# EAGLE design 40ish (EAGLE 9.6.1)
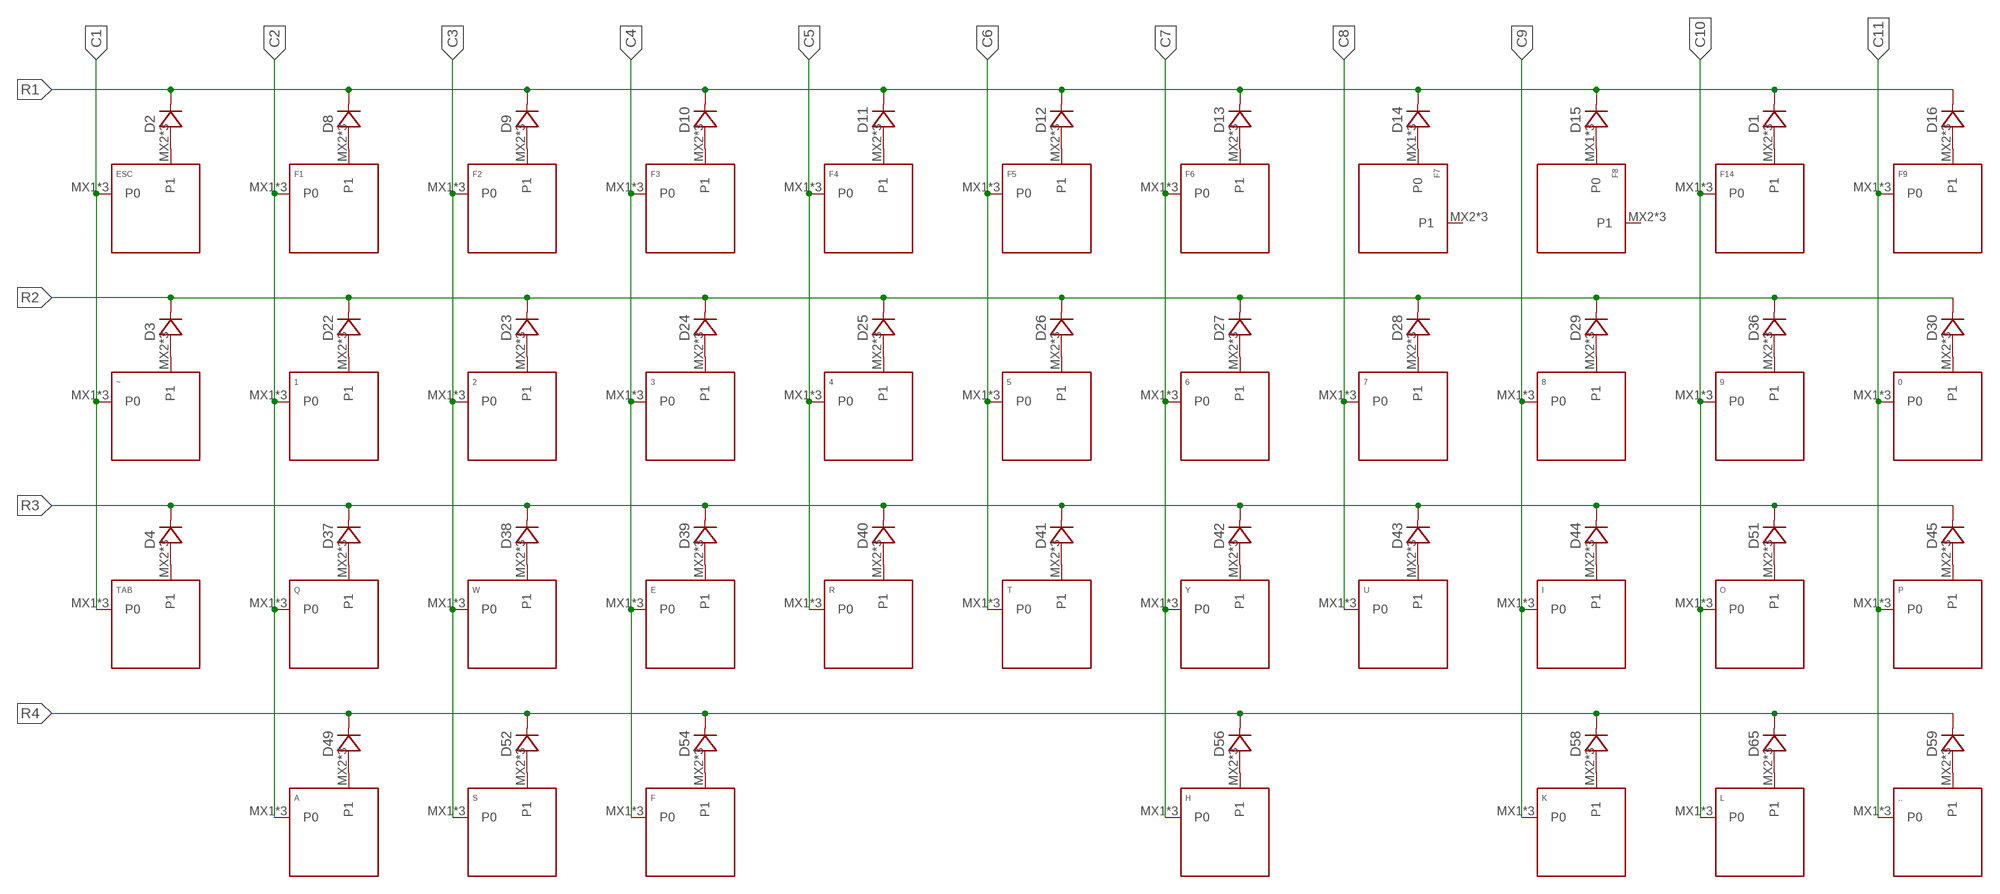
[diagram p0: schematic, sheet 1]

## Parts
0  KEYSWITCH-PLAIN-MXHSPCB-1U  [MXHSPCB-1U]
1  KEYSWITCH-PLAIN-MXHSPCB-1U  [MXHSPCB-1U]
2  KEYSWITCH-PLAIN-MXHSPCB-1U  [MXHSPCB-1U]
3  KEYSWITCH-PLAIN-MXHSPCB-1U  [MXHSPCB-1U]
4  KEYSWITCH-PLAIN-MXHSPCB-1U  [MXHSPCB-1U]
5  KEYSWITCH-PLAIN-MXHSPCB-1U  [MXHSPCB-1U]
6  KEYSWITCH-PLAIN-MXHSPCB-1U  [MXHSPCB-1U]
7  KEYSWITCH-PLAIN-MXHSPCB-1U  [MXHSPCB-1U]
8  KEYSWITCH-PLAIN-MXHSPCB-1U  [MXHSPCB-1U]
9  KEYSWITCH-PLAIN-MXHSPCB-1U  [MXHSPCB-1U]
..  KEYSWITCH-PLAIN-MXHSPCB-1U  [MXHSPCB-1U]
A  KEYSWITCH-PLAIN-MXHSPCB-1U  [MXHSPCB-1U]
D1  DIODE-SOD-123  [SOD-123]
D2  DIODE-SOD-123  [SOD-123]
D3  DIODE-SOD-123  [SOD-123]
D4  DIODE-SOD-123  [SOD-123]
D8  DIODE-SOD-123  [SOD-123]
D9  DIODE-SOD-123  [SOD-123]
D10  DIODE-SOD-123  [SOD-123]
D11  DIODE-SOD-123  [SOD-123]
D12  DIODE-SOD-123  [SOD-123]
D13  DIODE-SOD-123  [SOD-123]
D14  DIODE-SOD-123  [SOD-123]
D15  DIODE-SOD-123  [SOD-123]
D16  DIODE-SOD-123  [SOD-123]
D22  DIODE-SOD-123  [SOD-123]
D23  DIODE-SOD-123  [SOD-123]
D24  DIODE-SOD-123  [SOD-123]
D25  DIODE-SOD-123  [SOD-123]
D26  DIODE-SOD-123  [SOD-123]
D27  DIODE-SOD-123  [SOD-123]
D28  DIODE-SOD-123  [SOD-123]
D29  DIODE-SOD-123  [SOD-123]
D30  DIODE-SOD-123  [SOD-123]
D36  DIODE-SOD-123  [SOD-123]
D37  DIODE-SOD-123  [SOD-123]
D38  DIODE-SOD-123  [SOD-123]
D39  DIODE-SOD-123  [SOD-123]
D40  DIODE-SOD-123  [SOD-123]
D41  DIODE-SOD-123  [SOD-123]
D42  DIODE-SOD-123  [SOD-123]
D43  DIODE-SOD-123  [SOD-123]
D44  DIODE-SOD-123  [SOD-123]
D45  DIODE-SOD-123  [SOD-123]
D49  DIODE-SOD-123  [SOD-123]
D51  DIODE-SOD-123  [SOD-123]
D52  DIODE-SOD-123  [SOD-123]
D54  DIODE-SOD-123  [SOD-123]
D56  DIODE-SOD-123  [SOD-123]
D58  DIODE-SOD-123  [SOD-123]
D59  DIODE-SOD-123  [SOD-123]
D65  DIODE-SOD-123  [SOD-123]
E  KEYSWITCH-PLAIN-MXHSPCB-1U  [MXHSPCB-1U]
ESC  KEYSWITCH-PLAIN-MXHSPCB-1U  [MXHSPCB-1U]
F  KEYSWITCH-PLAIN-MXHSPCB-1U  [MXHSPCB-1U]
F1  KEYSWITCH-PLAIN-MXHSPCB-1U  [MXHSPCB-1U]
F2  KEYSWITCH-PLAIN-MXHSPCB-1U  [MXHSPCB-1U]
F3  KEYSWITCH-PLAIN-MXHSPCB-1U  [MXHSPCB-1U]
F4  KEYSWITCH-PLAIN-MXHSPCB-1U  [MXHSPCB-1U]
F5  KEYSWITCH-PLAIN-MXHSPCB-1U  [MXHSPCB-1U]
F6  KEYSWITCH-PLAIN-MXHSPCB-1U  [MXHSPCB-1U]
F7  KEYSWITCH-PLAIN-MXHSPCB-1U  [MXHSPCB-1U]
F8  KEYSWITCH-PLAIN-MXHSPCB-1U  [MXHSPCB-1U]
F9  KEYSWITCH-PLAIN-MXHSPCB-1U  [MXHSPCB-1U]
F14  KEYSWITCH-PLAIN-MXHSPCB-1U  [MXHSPCB-1U]
H  KEYSWITCH-PLAIN-MXHSPCB-1U  [MXHSPCB-1U]
I  KEYSWITCH-PLAIN-MXHSPCB-1U  [MXHSPCB-1U]
K  KEYSWITCH-PLAIN-MXHSPCB-1U  [MXHSPCB-1U]
L  KEYSWITCH-PLAIN-MXHSPCB-1U  [MXHSPCB-1U]
O  KEYSWITCH-PLAIN-MXHSPCB-1U  [MXHSPCB-1U]
P  KEYSWITCH-PLAIN-MXHSPCB-1U  [MXHSPCB-1U]
Q  KEYSWITCH-PLAIN-MXHSPCB-1U  [MXHSPCB-1U]
R  KEYSWITCH-PLAIN-MXHSPCB-1U  [MXHSPCB-1U]
S  KEYSWITCH-PLAIN-MXHSPCB-1U  [MXHSPCB-1U]
T  KEYSWITCH-PLAIN-MXHSPCB-1U  [MXHSPCB-1U]
TAB  KEYSWITCH-PLAIN-MXHSPCB-1U  [MXHSPCB-1U]
U  KEYSWITCH-PLAIN-MXHSPCB-1U  [MXHSPCB-1U]
W  KEYSWITCH-PLAIN-MXHSPCB-1U  [MXHSPCB-1U]
Y  KEYSWITCH-PLAIN-MXHSPCB-1U  [MXHSPCB-1U]
~  KEYSWITCH-PLAIN-MXHSPCB-1U  [MXHSPCB-1U]

## Nets
C1: ESC.MX1(P0) ESC.P$1(P0) ESC.P$2(P0) TAB.MX1(P0) TAB.P$1(P0) TAB.P$2(P0) ~.MX1(P0) ~.P$1(P0) ~.P$2(P0)
C2: 1.MX1(P0) 1.P$1(P0) 1.P$2(P0) A.MX1(P0) A.P$1(P0) A.P$2(P0) F1.MX1(P0) F1.P$1(P0) F1.P$2(P0) Q.MX1(P0) Q.P$1(P0) Q.P$2(P0)
C3: 2.MX1(P0) 2.P$1(P0) 2.P$2(P0) F2.MX1(P0) F2.P$1(P0) F2.P$2(P0) S.MX1(P0) S.P$1(P0) S.P$2(P0) W.MX1(P0) W.P$1(P0) W.P$2(P0)
C4: 3.MX1(P0) 3.P$1(P0) 3.P$2(P0) E.MX1(P0) E.P$1(P0) E.P$2(P0) F3.MX1(P0) F3.P$1(P0) F3.P$2(P0) F.MX1(P0) F.P$1(P0) F.P$2(P0)
C5: 4.MX1(P0) 4.P$1(P0) 4.P$2(P0) F4.MX1(P0) F4.P$1(P0) F4.P$2(P0) R.MX1(P0) R.P$1(P0) R.P$2(P0)
C6: 5.MX1(P0) 5.P$1(P0) 5.P$2(P0) F5.MX1(P0) F5.P$1(P0) F5.P$2(P0) T.MX1(P0) T.P$1(P0) T.P$2(P0)
C7: 6.MX1(P0) 6.P$1(P0) 6.P$2(P0) F6.MX1(P0) F6.P$1(P0) F6.P$2(P0) H.MX1(P0) H.P$1(P0) H.P$2(P0) Y.MX1(P0) Y.P$1(P0) Y.P$2(P0)
C8: 7.MX1(P0) 7.P$1(P0) 7.P$2(P0) U.MX1(P0) U.P$1(P0) U.P$2(P0)
C9: 8.MX1(P0) 8.P$1(P0) 8.P$2(P0) I.MX1(P0) I.P$1(P0) I.P$2(P0) K.MX1(P0) K.P$1(P0) K.P$2(P0)
C10: 9.MX1(P0) 9.P$1(P0) 9.P$2(P0) F14.MX1(P0) F14.P$1(P0) F14.P$2(P0) L.MX1(P0) L.P$1(P0) L.P$2(P0) O.MX1(P0) O.P$1(P0) O.P$2(P0)
C11: 0.MX1(P0) 0.P$1(P0) 0.P$2(P0) ...MX1(P0) ...P$1(P0) ...P$2(P0) F9.MX1(P0) F9.P$1(P0) F9.P$2(P0) P.MX1(P0) P.P$1(P0) P.P$2(P0)
N$1: D2.A ESC.MX2(P1) ESC.P$3(P1) ESC.P$4(P1)
N$2: D3.A ~.MX2(P1) ~.P$3(P1) ~.P$4(P1)
N$3: D4.A TAB.MX2(P1) TAB.P$3(P1) TAB.P$4(P1)
N$4: D1.A F14.MX2(P1) F14.P$3(P1) F14.P$4(P1)
N$8: D8.A F1.MX2(P1) F1.P$3(P1) F1.P$4(P1)
N$9: D9.A F2.MX2(P1) F2.P$3(P1) F2.P$4(P1)
N$10: D10.A F3.MX2(P1) F3.P$3(P1) F3.P$4(P1)
N$11: D11.A F4.MX2(P1) F4.P$3(P1) F4.P$4(P1)
N$12: D12.A F5.MX2(P1) F5.P$3(P1) F5.P$4(P1)
N$13: D13.A F6.MX2(P1) F6.P$3(P1) F6.P$4(P1)
N$14: D14.A F7.MX1(P0) F7.P$1(P0) F7.P$2(P0)
N$15: D15.A F8.MX1(P0) F8.P$1(P0) F8.P$2(P0)
N$16: D16.A F9.MX2(P1) F9.P$3(P1) F9.P$4(P1)
N$24: 1.MX2(P1) 1.P$3(P1) 1.P$4(P1) D22.A
N$25: 2.MX2(P1) 2.P$3(P1) 2.P$4(P1) D23.A
N$26: 3.MX2(P1) 3.P$3(P1) 3.P$4(P1) D24.A
N$27: 4.MX2(P1) 4.P$3(P1) 4.P$4(P1) D25.A
N$28: 5.MX2(P1) 5.P$3(P1) 5.P$4(P1) D26.A
N$29: 6.MX2(P1) 6.P$3(P1) 6.P$4(P1) D27.A
N$30: 7.MX2(P1) 7.P$3(P1) 7.P$4(P1) D28.A
N$31: 8.MX2(P1) 8.P$3(P1) 8.P$4(P1) D29.A
N$32: 0.MX2(P1) 0.P$3(P1) 0.P$4(P1) D30.A
N$38: 9.MX2(P1) 9.P$3(P1) 9.P$4(P1) D36.A
N$39: D37.A Q.MX2(P1) Q.P$3(P1) Q.P$4(P1)
N$40: D38.A W.MX2(P1) W.P$3(P1) W.P$4(P1)
N$41: D39.A E.MX2(P1) E.P$3(P1) E.P$4(P1)
N$42: D40.A R.MX2(P1) R.P$3(P1) R.P$4(P1)
N$43: D41.A T.MX2(P1) T.P$3(P1) T.P$4(P1)
N$44: D42.A Y.MX2(P1) Y.P$3(P1) Y.P$4(P1)
N$45: D43.A U.MX2(P1) U.P$3(P1) U.P$4(P1)
N$54: D44.A I.MX2(P1) I.P$3(P1) I.P$4(P1)
N$55: D51.A O.MX2(P1) O.P$3(P1) O.P$4(P1)
N$56: D45.A P.MX2(P1) P.P$3(P1) P.P$4(P1)
N$62: A.MX2(P1) A.P$3(P1) A.P$4(P1) D49.A
N$63: D52.A S.MX2(P1) S.P$3(P1) S.P$4(P1)
N$65: D54.A F.MX2(P1) F.P$3(P1) F.P$4(P1)
N$69: D56.A H.MX2(P1) H.P$3(P1) H.P$4(P1)
N$71: D58.A K.MX2(P1) K.P$3(P1) K.P$4(P1)
N$72: D65.A L.MX2(P1) L.P$3(P1) L.P$4(P1)
N$73: ...MX2(P1) ...P$3(P1) ...P$4(P1) D59.A
R1: D1.C D2.C D8.C D9.C D10.C D11.C D12.C D13.C D14.C D15.C D16.C
R2: D3.C D22.C D23.C D24.C D25.C D26.C D27.C D28.C D29.C D30.C D36.C
R3: D4.C D37.C D38.C D39.C D40.C D41.C D42.C D43.C D44.C D45.C D51.C
R4: D49.C D52.C D54.C D56.C D58.C D59.C D65.C
Unconnected: F7.MX2(P1) F7.P$3(P1) F7.P$4(P1) F8.MX2(P1) F8.P$3(P1) F8.P$4(P1)

## Library data of the parts
0 1-9 .. A E ESC F F1-F9 F14 H I K L O P Q R S T TAB U W Y ~ = Keyboard:KEYSWITCH-PLAIN
D1-D4 D8-D16 D22-D30 D36-D45 D49 D51 D52 D54 D56 D58 D59 D65 = Components:DIODE: Standard 1N4148 diode

## Board
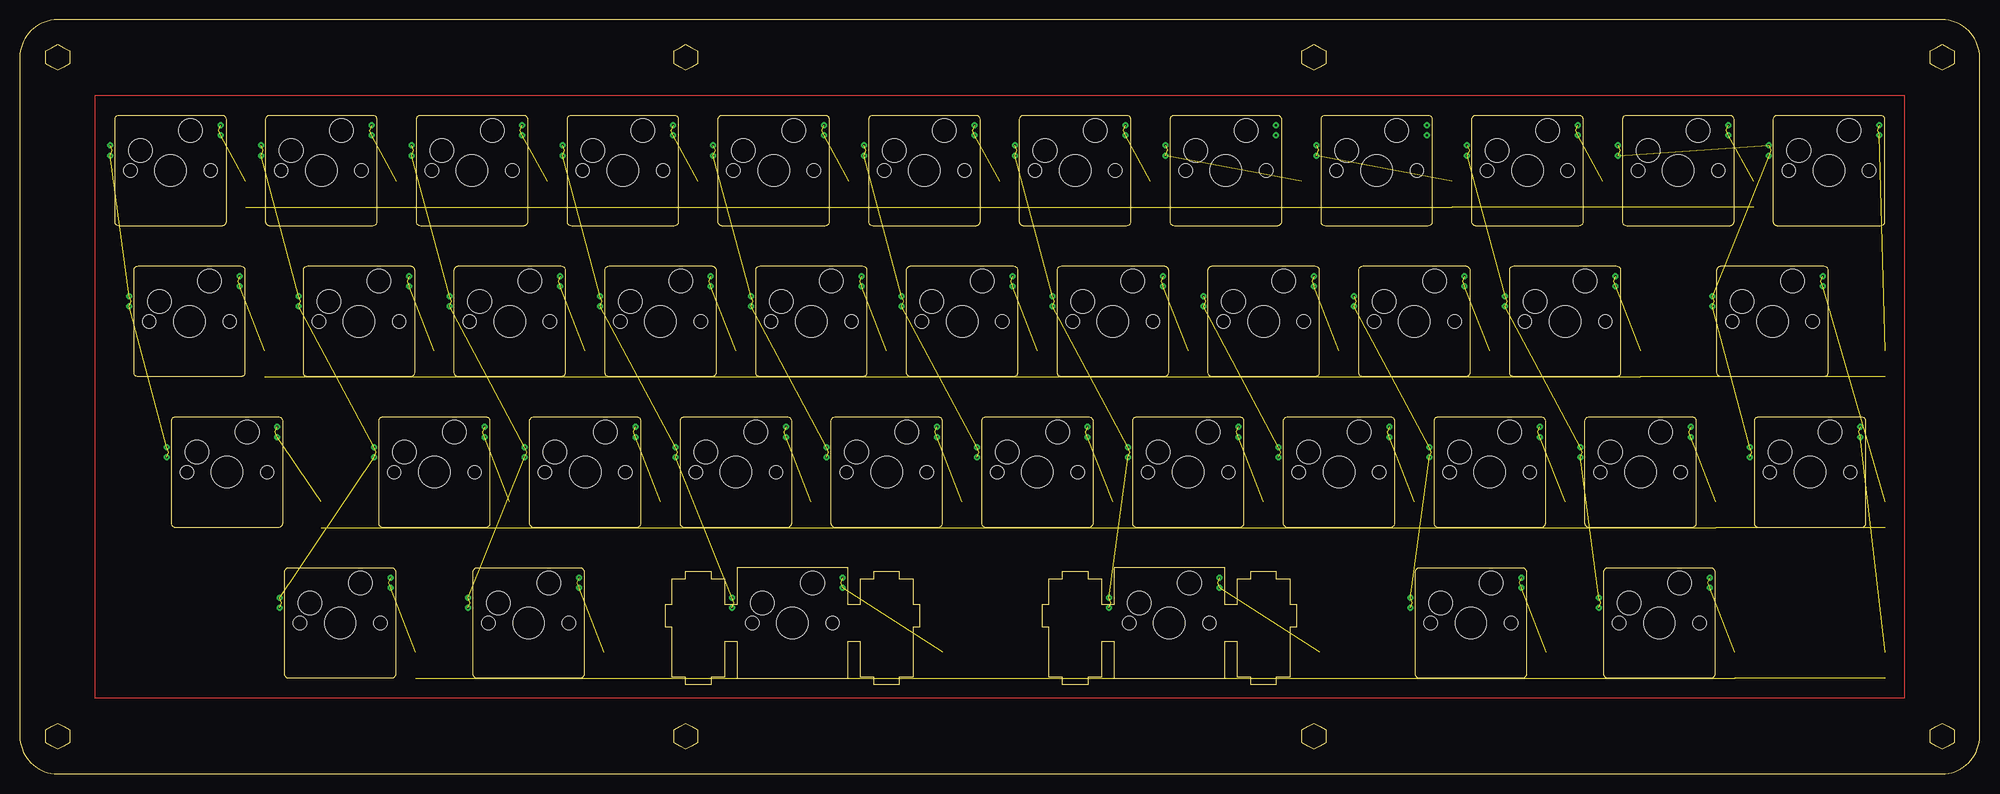
[diagram p1: board, top side]
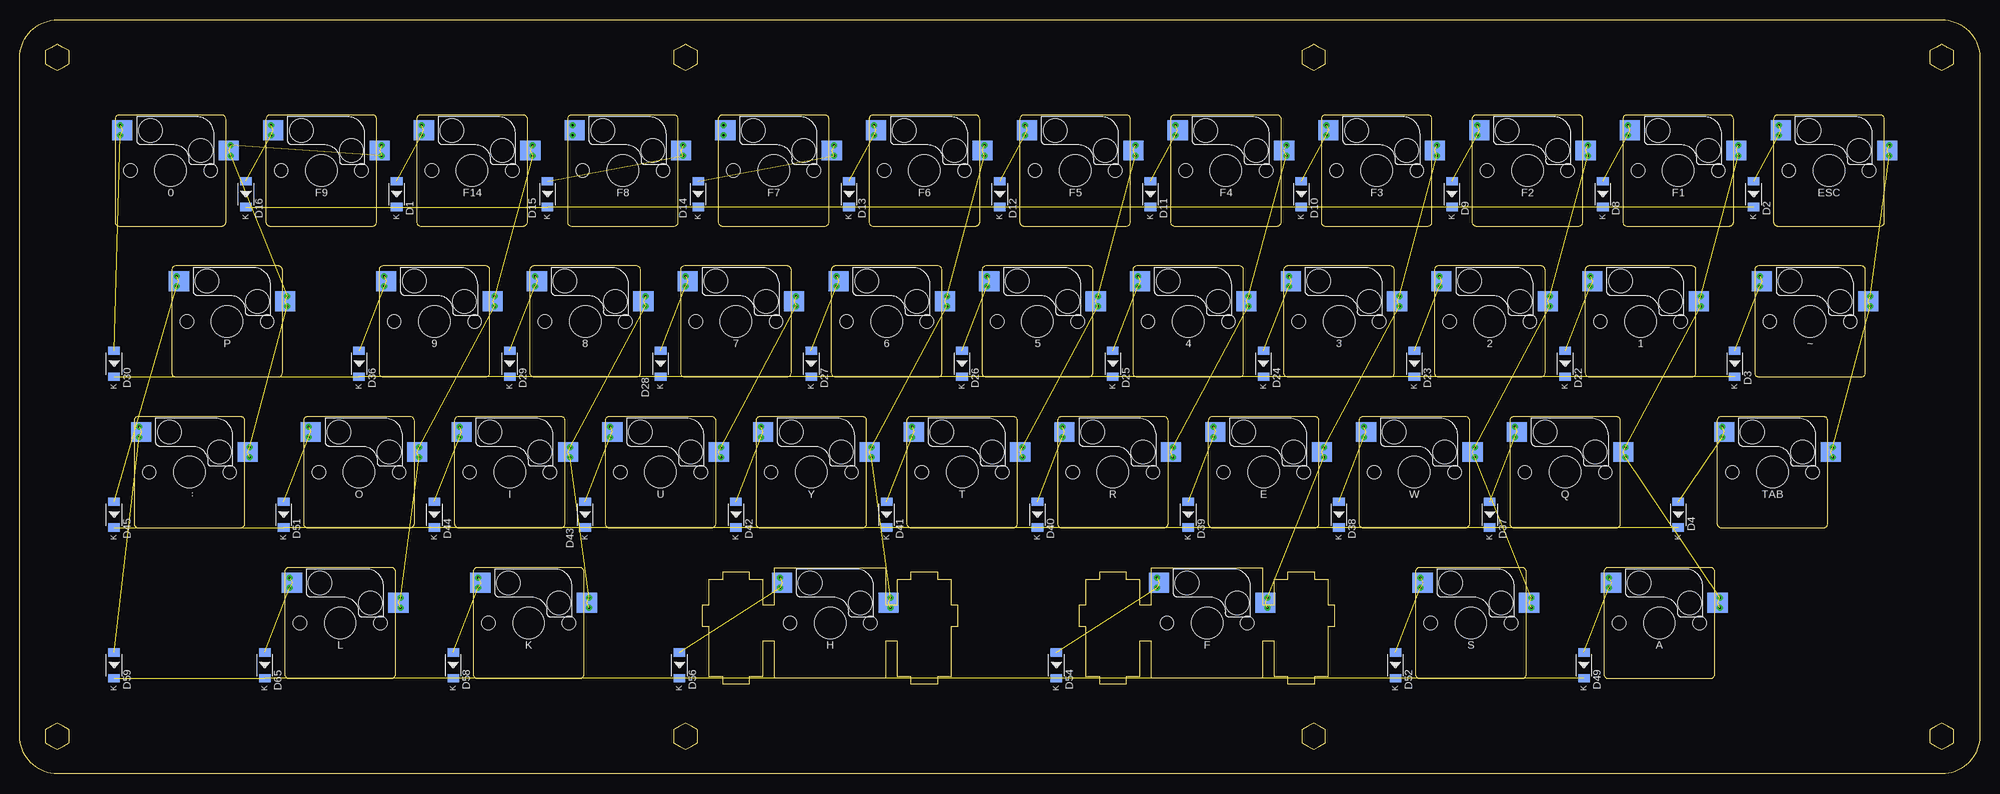
[diagram p2: board, bottom side, seen from below]

Size 247.65 x 95.25 mm. Coordinates in mm from the lower left corner, seen from the top.
Outline: 12.55,83.2 25.55,83.2 25.65,83.19 25.74,83.16 25.83,83.11 25.9,83.05 25.96,82.98 26.01,82.89 26.04,82.8 26.05,82.7 26.05,69.7 26.04,69.6 26.01,69.51 25.96,69.42 25.9,69.35 25.83,69.29 25.74,69.24 25.65,69.21 25.55,69.2 12.55,69.2 12.45,69.21 12.36,69.24 12.27,69.29 12.2,69.35 12.14,69.42 12.09,69.51 12.06,69.6 12.05,69.7 12.05,82.7 12.06,82.8 12.09,82.89 12.14,82.98 12.2,83.05 12.27,83.11 12.36,83.16 12.45,83.19 12.55,83.2
Outline: 31.6,83.2 44.6,83.2 44.7,83.19 44.79,83.16 44.88,83.11 44.95,83.05 45.01,82.98 45.06,82.89 45.09,82.8 45.1,82.7 45.1,69.7 45.09,69.6 45.06,69.51 45.01,69.42 44.95,69.35 44.88,69.29 44.79,69.24 44.7,69.21 44.6,69.2 31.6,69.2 31.5,69.21 31.41,69.24 31.32,69.29 31.25,69.35 31.19,69.42 31.14,69.51 31.11,69.6 31.1,69.7 31.1,82.7 31.11,82.8 31.14,82.89 31.19,82.98 31.25,83.05 31.32,83.11 31.41,83.16 31.5,83.19 31.6,83.2
Outline: 50.65,83.2 63.65,83.2 63.75,83.19 63.84,83.16 63.93,83.11 64,83.05 64.06,82.98 64.11,82.89 64.14,82.8 64.15,82.7 64.15,69.7 64.14,69.6 64.11,69.51 64.06,69.42 64,69.35 63.93,69.29 63.84,69.24 63.75,69.21 63.65,69.2 50.65,69.2 50.55,69.21 50.46,69.24 50.37,69.29 50.3,69.35 50.24,69.42 50.19,69.51 50.16,69.6 50.15,69.7 50.15,82.7 50.16,82.8 50.19,82.89 50.24,82.98 50.3,83.05 50.37,83.11 50.46,83.16 50.55,83.19 50.65,83.2
Outline: 69.7,83.2 82.7,83.2 82.8,83.19 82.89,83.16 82.98,83.11 83.05,83.05 83.11,82.98 83.16,82.89 83.19,82.8 83.2,82.7 83.2,69.7 83.19,69.6 83.16,69.51 83.11,69.42 83.05,69.35 82.98,69.29 82.89,69.24 82.8,69.21 82.7,69.2 69.7,69.2 69.6,69.21 69.51,69.24 69.42,69.29 69.35,69.35 69.29,69.42 69.24,69.51 69.21,69.6 69.2,69.7 69.2,82.7 69.21,82.8 69.24,82.89 69.29,82.98 69.35,83.05 69.42,83.11 69.51,83.16 69.6,83.19 69.7,83.2
Outline: 88.75,83.2 101.75,83.2 101.85,83.19 101.94,83.16 102.03,83.11 102.1,83.05 102.16,82.98 102.21,82.89 102.24,82.8 102.25,82.7 102.25,69.7 102.24,69.6 102.21,69.51 102.16,69.42 102.1,69.35 102.03,69.29 101.94,69.24 101.85,69.21 101.75,69.2 88.75,69.2 88.65,69.21 88.56,69.24 88.47,69.29 88.4,69.35 88.34,69.42 88.29,69.51 88.26,69.6 88.25,69.7 88.25,82.7 88.26,82.8 88.29,82.89 88.34,82.98 88.4,83.05 88.47,83.11 88.56,83.16 88.65,83.19 88.75,83.2
Outline: 107.8,83.2 120.8,83.2 120.9,83.19 120.99,83.16 121.08,83.11 121.15,83.05 121.21,82.98 121.26,82.89 121.29,82.8 121.3,82.7 121.3,69.7 121.29,69.6 121.26,69.51 121.21,69.42 121.15,69.35 121.08,69.29 120.99,69.24 120.9,69.21 120.8,69.2 107.8,69.2 107.7,69.21 107.61,69.24 107.52,69.29 107.45,69.35 107.39,69.42 107.34,69.51 107.31,69.6 107.3,69.7 107.3,82.7 107.31,82.8 107.34,82.89 107.39,82.98 107.45,83.05 107.52,83.11 107.61,83.16 107.7,83.19 107.8,83.2
Outline: 126.85,83.2 139.85,83.2 139.95,83.19 140.04,83.16 140.13,83.11 140.2,83.05 140.26,82.98 140.31,82.89 140.34,82.8 140.35,82.7 140.35,69.7 140.34,69.6 140.31,69.51 140.26,69.42 140.2,69.35 140.13,69.29 140.04,69.24 139.95,69.21 139.85,69.2 126.85,69.2 126.75,69.21 126.66,69.24 126.57,69.29 126.5,69.35 126.44,69.42 126.39,69.51 126.36,69.6 126.35,69.7 126.35,82.7 126.36,82.8 126.39,82.89 126.44,82.98 126.5,83.05 126.57,83.11 126.66,83.16 126.75,83.19 126.85,83.2
Outline: 145.9,83.2 158.9,83.2 159,83.19 159.09,83.16 159.18,83.11 159.25,83.05 159.31,82.98 159.36,82.89 159.39,82.8 159.4,82.7 159.4,69.7 159.39,69.6 159.36,69.51 159.31,69.42 159.25,69.35 159.18,69.29 159.09,69.24 159,69.21 158.9,69.2 145.9,69.2 145.8,69.21 145.71,69.24 145.62,69.29 145.55,69.35 145.49,69.42 145.44,69.51 145.41,69.6 145.4,69.7 145.4,82.7 145.41,82.8 145.44,82.89 145.49,82.98 145.55,83.05 145.62,83.11 145.71,83.16 145.8,83.19 145.9,83.2
Outline: 164.95,83.2 177.95,83.2 178.05,83.19 178.14,83.16 178.23,83.11 178.3,83.05 178.36,82.98 178.41,82.89 178.44,82.8 178.45,82.7 178.45,69.7 178.44,69.6 178.41,69.51 178.36,69.42 178.3,69.35 178.23,69.29 178.14,69.24 178.05,69.21 177.95,69.2 164.95,69.2 164.85,69.21 164.76,69.24 164.67,69.29 164.6,69.35 164.54,69.42 164.49,69.51 164.46,69.6 164.45,69.7 164.45,82.7 164.46,82.8 164.49,82.89 164.54,82.98 164.6,83.05 164.67,83.11 164.76,83.16 164.85,83.19 164.95,83.2
Outline: 184,83.2 197,83.2 197.1,83.19 197.19,83.16 197.28,83.11 197.35,83.05 197.41,82.98 197.46,82.89 197.49,82.8 197.5,82.7 197.5,69.7 197.49,69.6 197.46,69.51 197.41,69.42 197.35,69.35 197.28,69.29 197.19,69.24 197.1,69.21 197,69.2 184,69.2 183.9,69.21 183.81,69.24 183.72,69.29 183.65,69.35 183.59,69.42 183.54,69.51 183.51,69.6 183.5,69.7 183.5,82.7 183.51,82.8 183.54,82.89 183.59,82.98 183.65,83.05 183.72,83.11 183.81,83.16 183.9,83.19 184,83.2
Outline: 203.05,83.2 216.05,83.2 216.15,83.19 216.24,83.16 216.33,83.11 216.4,83.05 216.46,82.98 216.51,82.89 216.54,82.8 216.55,82.7 216.55,69.7 216.54,69.6 216.51,69.51 216.46,69.42 216.4,69.35 216.33,69.29 216.24,69.24 216.15,69.21 216.05,69.2 203.05,69.2 202.95,69.21 202.86,69.24 202.77,69.29 202.7,69.35 202.64,69.42 202.59,69.51 202.56,69.6 202.55,69.7 202.55,82.7 202.56,82.8 202.59,82.89 202.64,82.98 202.7,83.05 202.77,83.11 202.86,83.16 202.95,83.19 203.05,83.2
Outline: 222.1,83.2 235.1,83.2 235.2,83.19 235.29,83.16 235.38,83.11 235.45,83.05 235.51,82.98 235.56,82.89 235.59,82.8 235.6,82.7 235.6,69.7 235.59,69.6 235.56,69.51 235.51,69.42 235.45,69.35 235.38,69.29 235.29,69.24 235.2,69.21 235.1,69.2 222.1,69.2 222,69.21 221.91,69.24 221.82,69.29 221.75,69.35 221.69,69.42 221.64,69.51 221.61,69.6 221.6,69.7 221.6,82.7 221.61,82.8 221.64,82.89 221.69,82.98 221.75,83.05 221.82,83.11 221.91,83.16 222,83.19 222.1,83.2
Outline: 14.93,64.15 27.93,64.15 28.03,64.14 28.12,64.11 28.21,64.06 28.28,64 28.34,63.93 28.39,63.84 28.42,63.75 28.43,63.65 28.43,50.65 28.42,50.55 28.39,50.46 28.34,50.37 28.28,50.3 28.21,50.24 28.12,50.19 28.03,50.16 27.93,50.15 14.93,50.15 14.83,50.16 14.74,50.19 14.65,50.24 14.58,50.3 14.52,50.37 14.47,50.46 14.44,50.55 14.43,50.65 14.43,63.65 14.44,63.75 14.47,63.84 14.52,63.93 14.58,64 14.65,64.06 14.74,64.11 14.83,64.14 14.93,64.15
Outline: 36.37,64.15 49.36,64.15 49.46,64.14 49.55,64.11 49.64,64.06 49.71,64 49.78,63.93 49.82,63.84 49.85,63.75 49.86,63.65 49.86,50.65 49.85,50.55 49.82,50.46 49.78,50.37 49.71,50.3 49.64,50.24 49.55,50.19 49.46,50.16 49.36,50.15 36.37,50.15 36.26,50.16 36.17,50.19 36.08,50.24 36.01,50.3 35.95,50.37 35.9,50.46 35.87,50.55 35.86,50.65 35.86,63.65 35.87,63.75 35.9,63.84 35.95,63.93 36.01,64 36.08,64.06 36.17,64.11 36.26,64.14 36.37,64.15
Outline: 55.42,64.15 68.41,64.15 68.51,64.14 68.6,64.11 68.69,64.06 68.76,64 68.83,63.93 68.87,63.84 68.9,63.75 68.91,63.65 68.91,50.65 68.9,50.55 68.87,50.46 68.83,50.37 68.76,50.3 68.69,50.24 68.6,50.19 68.51,50.16 68.41,50.15 55.42,50.15 55.31,50.16 55.22,50.19 55.13,50.24 55.06,50.3 55,50.37 54.95,50.46 54.92,50.55 54.91,50.65 54.91,63.65 54.92,63.75 54.95,63.84 55,63.93 55.06,64 55.13,64.06 55.22,64.11 55.31,64.14 55.42,64.15
Outline: 74.47,64.15 87.46,64.15 87.56,64.14 87.65,64.11 87.74,64.06 87.81,64 87.88,63.93 87.92,63.84 87.95,63.75 87.96,63.65 87.96,50.65 87.95,50.55 87.92,50.46 87.88,50.37 87.81,50.3 87.74,50.24 87.65,50.19 87.56,50.16 87.46,50.15 74.47,50.15 74.36,50.16 74.27,50.19 74.18,50.24 74.11,50.3 74.05,50.37 74,50.46 73.97,50.55 73.96,50.65 73.96,63.65 73.97,63.75 74,63.84 74.05,63.93 74.11,64 74.18,64.06 74.27,64.11 74.36,64.14 74.47,64.15
Outline: 93.52,64.15 106.51,64.15 106.61,64.14 106.7,64.11 106.79,64.06 106.86,64 106.93,63.93 106.97,63.84 107,63.75 107.01,63.65 107.01,50.65 107,50.55 106.97,50.46 106.93,50.37 106.86,50.3 106.79,50.24 106.7,50.19 106.61,50.16 106.51,50.15 93.52,50.15 93.41,50.16 93.32,50.19 93.23,50.24 93.16,50.3 93.1,50.37 93.05,50.46 93.02,50.55 93.01,50.65 93.01,63.65 93.02,63.75 93.05,63.84 93.1,63.93 93.16,64 93.23,64.06 93.32,64.11 93.41,64.14 93.52,64.15
Outline: 112.57,64.15 125.56,64.15 125.66,64.14 125.75,64.11 125.84,64.06 125.91,64 125.98,63.93 126.02,63.84 126.05,63.75 126.06,63.65 126.06,50.65 126.05,50.55 126.02,50.46 125.98,50.37 125.91,50.3 125.84,50.24 125.75,50.19 125.66,50.16 125.56,50.15 112.57,50.15 112.46,50.16 112.37,50.19 112.28,50.24 112.21,50.3 112.15,50.37 112.1,50.46 112.07,50.55 112.06,50.65 112.06,63.65 112.07,63.75 112.1,63.84 112.15,63.93 112.21,64 112.28,64.06 112.37,64.11 112.46,64.14 112.57,64.15
Outline: 131.62,64.15 144.61,64.15 144.71,64.14 144.8,64.11 144.89,64.06 144.96,64 145.03,63.93 145.07,63.84 145.1,63.75 145.11,63.65 145.11,50.65 145.1,50.55 145.07,50.46 145.03,50.37 144.96,50.3 144.89,50.24 144.8,50.19 144.71,50.16 144.61,50.15 131.62,50.15 131.51,50.16 131.42,50.19 131.33,50.24 131.26,50.3 131.2,50.37 131.15,50.46 131.12,50.55 131.11,50.65 131.11,63.65 131.12,63.75 131.15,63.84 131.2,63.93 131.26,64 131.33,64.06 131.42,64.11 131.51,64.14 131.62,64.15
Outline: 150.67,64.15 163.66,64.15 163.76,64.14 163.85,64.11 163.94,64.06 164.01,64 164.08,63.93 164.12,63.84 164.15,63.75 164.16,63.65 164.16,50.65 164.15,50.55 164.12,50.46 164.08,50.37 164.01,50.3 163.94,50.24 163.85,50.19 163.76,50.16 163.66,50.15 150.67,50.15 150.56,50.16 150.47,50.19 150.38,50.24 150.31,50.3 150.25,50.37 150.2,50.46 150.17,50.55 150.16,50.65 150.16,63.65 150.17,63.75 150.2,63.84 150.25,63.93 150.31,64 150.38,64.06 150.47,64.11 150.56,64.14 150.67,64.15
Outline: 169.72,64.15 182.71,64.15 182.81,64.14 182.9,64.11 182.99,64.06 183.06,64 183.13,63.93 183.17,63.84 183.2,63.75 183.21,63.65 183.21,50.65 183.2,50.55 183.17,50.46 183.13,50.37 183.06,50.3 182.99,50.24 182.9,50.19 182.81,50.16 182.71,50.15 169.72,50.15 169.61,50.16 169.52,50.19 169.43,50.24 169.36,50.3 169.3,50.37 169.25,50.46 169.22,50.55 169.21,50.65 169.21,63.65 169.22,63.75 169.25,63.84 169.3,63.93 169.36,64 169.43,64.06 169.52,64.11 169.61,64.14 169.72,64.15
Outline: 188.77,64.15 201.76,64.15 201.86,64.14 201.95,64.11 202.04,64.06 202.11,64 202.18,63.93 202.22,63.84 202.25,63.75 202.26,63.65 202.26,50.65 202.25,50.55 202.22,50.46 202.18,50.37 202.11,50.3 202.04,50.24 201.95,50.19 201.86,50.16 201.76,50.15 188.77,50.15 188.66,50.16 188.57,50.19 188.48,50.24 188.41,50.3 188.35,50.37 188.3,50.46 188.27,50.55 188.26,50.65 188.26,63.65 188.27,63.75 188.3,63.84 188.35,63.93 188.41,64 188.48,64.06 188.57,64.11 188.66,64.14 188.77,64.15
Outline: 214.96,64.15 227.95,64.15 228.05,64.14 228.15,64.11 228.23,64.06 228.31,64 228.37,63.93 228.42,63.84 228.45,63.75 228.46,63.65 228.46,50.65 228.45,50.55 228.42,50.46 228.37,50.37 228.31,50.3 228.23,50.24 228.15,50.19 228.05,50.16 227.95,50.15 214.96,50.15 214.86,50.16 214.76,50.19 214.68,50.24 214.6,50.3 214.54,50.37 214.5,50.46 214.47,50.55 214.46,50.65 214.46,63.65 214.47,63.75 214.5,63.84 214.54,63.93 214.6,64 214.68,64.06 214.76,64.11 214.86,64.14 214.96,64.15
Outline: 19.7,45.1 32.69,45.1 32.79,45.09 32.89,45.06 32.97,45.01 33.05,44.95 33.11,44.88 33.15,44.79 33.18,44.7 33.19,44.6 33.19,31.6 33.18,31.5 33.15,31.41 33.11,31.32 33.05,31.25 32.97,31.19 32.89,31.14 32.79,31.11 32.69,31.1 19.7,31.1 19.6,31.11 19.5,31.14 19.42,31.19 19.34,31.25 19.28,31.32 19.23,31.41 19.2,31.5 19.19,31.6 19.19,44.6 19.2,44.7 19.23,44.79 19.28,44.88 19.34,44.95 19.42,45.01 19.5,45.06 19.6,45.09 19.7,45.1
Outline: 45.89,45.1 58.88,45.1 58.98,45.09 59.08,45.06 59.16,45.01 59.24,44.95 59.3,44.88 59.35,44.79 59.38,44.7 59.39,44.6 59.39,31.6 59.38,31.5 59.35,31.41 59.3,31.32 59.24,31.25 59.16,31.19 59.08,31.14 58.98,31.11 58.88,31.1 45.89,31.1 45.79,31.11 45.7,31.14 45.61,31.19 45.54,31.25 45.47,31.32 45.43,31.41 45.4,31.5 45.39,31.6 45.39,44.6 45.4,44.7 45.43,44.79 45.47,44.88 45.54,44.95 45.61,45.01 45.7,45.06 45.79,45.09 45.89,45.1
Outline: 64.94,45.1 77.93,45.1 78.03,45.09 78.13,45.06 78.21,45.01 78.29,44.95 78.35,44.88 78.4,44.79 78.43,44.7 78.44,44.6 78.44,31.6 78.43,31.5 78.4,31.41 78.35,31.32 78.29,31.25 78.21,31.19 78.13,31.14 78.03,31.11 77.93,31.1 64.94,31.1 64.84,31.11 64.75,31.14 64.66,31.19 64.59,31.25 64.52,31.32 64.48,31.41 64.45,31.5 64.44,31.6 64.44,44.6 64.45,44.7 64.48,44.79 64.52,44.88 64.59,44.95 64.66,45.01 64.75,45.06 64.84,45.09 64.94,45.1
Outline: 83.99,45.1 96.98,45.1 97.08,45.09 97.18,45.06 97.26,45.01 97.34,44.95 97.4,44.88 97.45,44.79 97.48,44.7 97.49,44.6 97.49,31.6 97.48,31.5 97.45,31.41 97.4,31.32 97.34,31.25 97.26,31.19 97.18,31.14 97.08,31.11 96.98,31.1 83.99,31.1 83.89,31.11 83.8,31.14 83.71,31.19 83.63,31.25 83.57,31.32 83.53,31.41 83.5,31.5 83.49,31.6 83.49,44.6 83.5,44.7 83.53,44.79 83.57,44.88 83.63,44.95 83.71,45.01 83.8,45.06 83.89,45.09 83.99,45.1
Outline: 103.04,45.1 116.03,45.1 116.13,45.09 116.23,45.06 116.31,45.01 116.39,44.95 116.45,44.88 116.5,44.79 116.53,44.7 116.54,44.6 116.54,31.6 116.53,31.5 116.5,31.41 116.45,31.32 116.39,31.25 116.31,31.19 116.23,31.14 116.13,31.11 116.03,31.1 103.04,31.1 102.94,31.11 102.85,31.14 102.76,31.19 102.68,31.25 102.62,31.32 102.58,31.41 102.55,31.5 102.54,31.6 102.54,44.6 102.55,44.7 102.58,44.79 102.62,44.88 102.68,44.95 102.76,45.01 102.85,45.06 102.94,45.09 103.04,45.1
Outline: 122.09,45.1 135.08,45.1 135.18,45.09 135.28,45.06 135.36,45.01 135.44,44.95 135.5,44.88 135.55,44.79 135.58,44.7 135.59,44.6 135.59,31.6 135.58,31.5 135.55,31.41 135.5,31.32 135.44,31.25 135.36,31.19 135.28,31.14 135.18,31.11 135.08,31.1 122.09,31.1 121.99,31.11 121.89,31.14 121.81,31.19 121.73,31.25 121.67,31.32 121.63,31.41 121.6,31.5 121.59,31.6 121.59,44.6 121.6,44.7 121.63,44.79 121.67,44.88 121.73,44.95 121.81,45.01 121.89,45.06 121.99,45.09 122.09,45.1
Outline: 141.14,45.1 154.13,45.1 154.23,45.09 154.33,45.06 154.41,45.01 154.49,44.95 154.55,44.88 154.6,44.79 154.63,44.7 154.64,44.6 154.64,31.6 154.63,31.5 154.6,31.41 154.55,31.32 154.49,31.25 154.41,31.19 154.33,31.14 154.23,31.11 154.13,31.1 141.14,31.1 141.04,31.11 140.94,31.14 140.86,31.19 140.78,31.25 140.72,31.32 140.68,31.41 140.65,31.5 140.64,31.6 140.64,44.6 140.65,44.7 140.68,44.79 140.72,44.88 140.78,44.95 140.86,45.01 140.94,45.06 141.04,45.09 141.14,45.1
Outline: 160.19,45.1 173.18,45.1 173.28,45.09 173.38,45.06 173.46,45.01 173.54,44.95 173.6,44.88 173.65,44.79 173.68,44.7 173.69,44.6 173.69,31.6 173.68,31.5 173.65,31.41 173.6,31.32 173.54,31.25 173.46,31.19 173.38,31.14 173.28,31.11 173.18,31.1 160.19,31.1 160.09,31.11 159.99,31.14 159.91,31.19 159.83,31.25 159.77,31.32 159.73,31.41 159.7,31.5 159.69,31.6 159.69,44.6 159.7,44.7 159.73,44.79 159.77,44.88 159.83,44.95 159.91,45.01 159.99,45.06 160.09,45.09 160.19,45.1
Outline: 179.24,45.1 192.23,45.1 192.33,45.09 192.43,45.06 192.51,45.01 192.59,44.95 192.65,44.88 192.7,44.79 192.73,44.7 192.74,44.6 192.74,31.6 192.73,31.5 192.7,31.41 192.65,31.32 192.59,31.25 192.51,31.19 192.43,31.14 192.33,31.11 192.23,31.1 179.24,31.1 179.14,31.11 179.04,31.14 178.96,31.19 178.88,31.25 178.82,31.32 178.78,31.41 178.75,31.5 178.74,31.6 178.74,44.6 178.75,44.7 178.78,44.79 178.82,44.88 178.88,44.95 178.96,45.01 179.04,45.06 179.14,45.09 179.24,45.1
Outline: 198.29,45.1 211.28,45.1 211.38,45.09 211.48,45.06 211.56,45.01 211.64,44.95 211.7,44.88 211.75,44.79 211.78,44.7 211.79,44.6 211.79,31.6 211.78,31.5 211.75,31.41 211.7,31.32 211.64,31.25 211.56,31.19 211.48,31.14 211.38,31.11 211.28,31.1 198.29,31.1 198.19,31.11 198.09,31.14 198.01,31.19 197.93,31.25 197.87,31.32 197.83,31.41 197.8,31.5 197.79,31.6 197.79,44.6 197.8,44.7 197.83,44.79 197.87,44.88 197.93,44.95 198.01,45.01 198.09,45.06 198.19,45.09 198.29,45.1
Outline: 219.72,45.1 232.71,45.1 232.82,45.09 232.91,45.06 233,45.01 233.07,44.95 233.13,44.88 233.18,44.79 233.21,44.7 233.22,44.6 233.22,31.6 233.21,31.5 233.18,31.41 233.13,31.32 233.07,31.25 233,31.19 232.91,31.14 232.82,31.11 232.71,31.1 219.72,31.1 219.62,31.11 219.53,31.14 219.44,31.19 219.37,31.25 219.3,31.32 219.26,31.41 219.23,31.5 219.22,31.6 219.22,44.6 219.23,44.7 219.26,44.79 219.3,44.88 219.37,44.95 219.44,45.01 219.53,45.06 219.62,45.09 219.72,45.1
Outline: 33.98,26.05 46.98,26.05 47.08,26.04 47.17,26.01 47.26,25.96 47.33,25.9 47.39,25.83 47.44,25.74 47.47,25.65 47.48,25.55 47.48,12.55 47.47,12.45 47.44,12.36 47.39,12.27 47.33,12.2 47.26,12.14 47.17,12.09 47.08,12.06 46.98,12.05 33.98,12.05 33.88,12.06 33.79,12.09 33.7,12.14 33.63,12.2 33.57,12.27 33.52,12.36 33.49,12.45 33.48,12.55 33.48,25.55 33.49,25.65 33.52,25.74 33.57,25.83 33.63,25.9 33.7,25.96 33.79,26.01 33.88,26.04 33.98,26.05
Outline: 57.8,26.05 70.79,26.05 70.89,26.04 70.99,26.01 71.07,25.96 71.15,25.9 71.21,25.83 71.25,25.74 71.28,25.65 71.29,25.55 71.29,12.55 71.28,12.45 71.25,12.36 71.21,12.27 71.15,12.2 71.07,12.14 70.99,12.09 70.89,12.06 70.79,12.05 57.8,12.05 57.7,12.06 57.6,12.09 57.52,12.14 57.44,12.2 57.38,12.27 57.33,12.36 57.3,12.45 57.29,12.55 57.29,25.55 57.3,25.65 57.33,25.74 57.38,25.83 57.44,25.9 57.52,25.96 57.6,26.01 57.7,26.04 57.8,26.05
Outline: 90.63,26.04 90.63,21.34 89.11,21.34 89.11,24.57 87.38,24.57 87.38,25.49 84.08,25.49 84.08,24.57 82.36,24.57 82.36,21.34 81.53,21.34 81.53,18.54 82.36,18.54 82.36,12.27 84.08,12.27 84.08,11.29 87.38,11.29 87.38,12.27 89.11,12.27 89.11,16.74 90.63,16.74 90.63,12.04 104.63,12.04 104.63,16.74 106.16,16.74 106.16,12.27 107.88,12.27 107.88,11.29 111.18,11.29 111.18,12.27 112.91,12.27 112.91,18.54 113.73,18.54 113.73,21.34 112.91,21.34 112.91,24.57 111.18,24.57 111.18,25.49 107.88,25.49 107.88,24.57 106.16,24.57 106.16,21.34 104.63,21.34 104.63,26.04 90.63,26.04
Outline: 138.26,26.04 138.26,21.34 136.73,21.34 136.73,24.57 135.01,24.57 135.01,25.49 131.71,25.49 131.71,24.57 129.98,24.57 129.98,21.34 129.16,21.34 129.16,18.54 129.98,18.54 129.98,12.27 131.71,12.27 131.71,11.29 135.01,11.29 135.01,12.27 136.73,12.27 136.73,16.74 138.26,16.74 138.26,12.04 152.26,12.04 152.26,16.74 153.78,16.74 153.78,12.27 155.51,12.27 155.51,11.29 158.81,11.29 158.81,12.27 160.53,12.27 160.53,18.54 161.36,18.54 161.36,21.34 160.53,21.34 160.53,24.57 158.81,24.57 158.81,25.49 155.51,25.49 155.51,24.57 153.78,24.57 153.78,21.34 152.26,21.34 152.26,26.04 138.26,26.04
Outline: 176.86,26.05 189.85,26.05 189.95,26.04 190.05,26.01 190.13,25.96 190.21,25.9 190.27,25.83 190.32,25.74 190.35,25.65 190.36,25.55 190.36,12.55 190.35,12.45 190.32,12.36 190.27,12.27 190.21,12.2 190.13,12.14 190.05,12.09 189.95,12.06 189.85,12.05 176.86,12.05 176.76,12.06 176.66,12.09 176.58,12.14 176.5,12.2 176.44,12.27 176.4,12.36 176.37,12.45 176.36,12.55 176.36,25.55 176.37,25.65 176.4,25.74 176.44,25.83 176.5,25.9 176.58,25.96 176.66,26.01 176.76,26.04 176.86,26.05
Outline: 200.67,26.05 213.66,26.05 213.77,26.04 213.86,26.01 213.95,25.96 214.02,25.9 214.08,25.83 214.13,25.74 214.16,25.65 214.17,25.55 214.17,12.55 214.16,12.45 214.13,12.36 214.08,12.27 214.02,12.2 213.95,12.14 213.86,12.09 213.77,12.06 213.66,12.05 200.67,12.05 200.57,12.06 200.48,12.09 200.39,12.14 200.32,12.2 200.25,12.27 200.21,12.36 200.18,12.45 200.17,12.55 200.17,25.55 200.18,25.65 200.21,25.74 200.25,25.83 200.32,25.9 200.39,25.96 200.48,26.01 200.57,26.04 200.67,26.05
Outline: 4.78,92.16 5.53,91.74 6.28,91.33 6.28,89.68 5.53,89.27 4.78,88.86 4.03,89.27 3.28,89.68 3.28,91.33 4.03,91.74 4.78,92.16
Outline: 84.15,92.16 84.9,91.74 85.65,91.33 85.65,89.68 84.9,89.27 84.15,88.86 83.4,89.27 82.65,89.68 82.65,91.33 83.4,91.74 84.15,92.16
Outline: 163.53,92.16 164.28,91.74 165.03,91.33 165.03,89.68 164.28,89.27 163.53,88.86 162.78,89.27 162.03,89.68 162.03,91.33 162.78,91.74 163.53,92.16
Outline: 242.91,92.16 243.66,91.74 244.41,91.33 244.41,89.68 243.66,89.27 242.91,88.86 242.16,89.27 241.41,89.68 241.41,91.33 242.16,91.74 242.91,92.16
Outline: 4.78,6.39 5.53,5.98 6.28,5.57 6.28,3.92 5.53,3.51 4.78,3.09 4.03,3.51 3.28,3.92 3.28,5.57 4.03,5.98 4.78,6.39
Outline: 84.15,6.39 84.9,5.98 85.65,5.57 85.65,3.92 84.9,3.51 84.15,3.09 83.4,3.51 82.65,3.92 82.65,5.57 83.4,5.98 84.15,6.39
Outline: 163.53,6.39 164.28,5.98 165.03,5.57 165.03,3.92 164.28,3.51 163.53,3.09 162.78,3.51 162.03,3.92 162.03,5.57 162.78,5.98 163.53,6.39
Outline: 242.91,6.39 243.66,5.98 244.41,5.57 244.41,3.92 243.66,3.51 242.91,3.09 242.16,3.51 241.41,3.92 241.41,5.57 242.16,5.98 242.91,6.39
Outline: 0,4.76 0.02,4.35 0.07,3.94 0.16,3.53 0.29,3.13 0.45,2.75 0.64,2.38 0.86,2.03 1.11,1.7 1.39,1.39 1.7,1.11 2.03,0.86 2.38,0.64 2.75,0.45 3.13,0.29 3.53,0.16 3.94,0.07 4.35,0.02 4.76,0 242.89,0 243.3,0.02 243.71,0.07 244.12,0.16 244.52,0.29 244.9,0.45 245.27,0.64 245.62,0.86 245.95,1.11 246.25,1.39 246.54,1.7 246.79,2.03 247.01,2.38 247.2,2.75 247.36,3.13 247.49,3.53 247.58,3.94 247.63,4.35 247.65,4.76 247.65,90.49 247.63,90.9 247.58,91.31 247.49,91.72 247.36,92.12 247.2,92.5 247.01,92.87 246.79,93.22 246.54,93.55 246.25,93.85 245.95,94.14 245.62,94.39 245.27,94.61 244.9,94.8 244.52,94.96 244.12,95.09 243.71,95.18 243.3,95.23 242.89,95.25 4.76,95.25 4.35,95.23 3.94,95.18 3.53,95.09 3.13,94.96 2.75,94.8 2.38,94.61 2.03,94.39 1.7,94.14 1.39,93.85 1.11,93.55 0.86,93.22 0.64,92.87 0.45,92.5 0.29,92.12 0.16,91.72 0.07,91.31 0.02,90.9 0,90.49 0,4.76
Copper layers (1*16): Top 0.035mm / dielectric 1.5mm / Bottom 0.035mm
Design rules "default *": minimum track width 6mil, minimum drill 0.35mm, track to track 6mil, track to pad 6mil, pad to pad 6mil, via to via 6mil, smd to smd 6mil, copper to edge 25mil, drill to drill 6mil, minimum pad ring 10mil, minimum via ring 8mil, stop-mask expansion 4mil, vias tented up to drill 14mil, thermal gap 10mil

### Footprints (pad centres in the part's own frame; a part is rotated, then mirrored left to right if it is on the bottom)
MXHSPCB-1U = smd 2.55 x 2.5: MX1 7.36,2.54; MX2 -6.09,5.08 | drill 0.25 pad 0.406: P$1 7.62,3.175; P$2 7.62,1.905; P$3 -6.35,5.715; P$4 -6.35,4.445 | hole 4: 0,0 | hole 1.7: 5.08,0; -5.08,0 | hole 3: 3.81,2.54; -2.54,5.08
SOD-123 = smd 1.037 x 1.474: A -1.635,0; C 1.635,0

### Placement (x,y rotation side)
0  228.6,76.2 0 bottom
1  42.86,57.15 0 bottom
2  61.91,57.15 0 bottom
3  80.96,57.15 0 bottom
4  100.01,57.15 0 bottom
5  119.06,57.15 0 bottom
6  138.11,57.15 0 bottom
7  157.16,57.15 0 bottom
8  176.21,57.15 0 bottom
9  195.26,57.15 0 bottom
..  226.22,38.1 0 bottom
A  40.48,19.05 0 bottom
D1  200.02,73.22 270 bottom
D2  28.57,73.22 270 bottom
D3  30.96,51.79 270 bottom
D4  38.1,32.74 270 bottom
D8  47.62,73.22 270 bottom
D9  66.67,73.22 270 bottom
D10  85.72,73.22 270 bottom
D11  104.77,73.22 270 bottom
D12  123.82,73.22 270 bottom
D13  142.87,73.22 270 bottom
D14  161.92,73.22 270 bottom
D15  180.97,73.22 270 bottom
D16  219.07,73.22 270 bottom
D22  52.39,51.79 270 bottom
D23  71.44,51.79 270 bottom
D24  90.49,51.79 270 bottom
D25  109.54,51.79 270 bottom
D26  128.59,51.79 270 bottom
D27  147.64,51.79 270 bottom
D28  166.69,51.79 270 bottom
D29  185.74,51.79 270 bottom
D30  235.74,51.79 270 bottom
D36  204.79,51.79 270 bottom
D37  61.91,32.74 270 bottom
D38  80.96,32.74 270 bottom
D39  100.01,32.74 270 bottom
D40  119.06,32.74 270 bottom
D41  138.11,32.74 270 bottom
D42  157.16,32.74 270 bottom
D43  176.21,32.74 270 bottom
D44  195.26,32.74 270 bottom
D45  235.74,32.74 270 bottom
D49  50.01,13.69 270 bottom
D51  214.31,32.74 270 bottom
D52  73.82,13.69 270 bottom
D54  116.68,13.69 270 bottom
D56  164.31,13.69 270 bottom
D58  192.88,13.69 270 bottom
D59  235.74,13.69 270 bottom
D65  216.69,13.69 270 bottom
E  90.49,38.1 0 bottom
ESC  19.05,76.2 0 bottom
F  97.63,19.05 0 bottom
F1  38.1,76.2 0 bottom
F2  57.15,76.2 0 bottom
F3  76.2,76.2 0 bottom
F4  95.25,76.2 0 bottom
F5  114.3,76.2 0 bottom
F6  133.35,76.2 0 bottom
F7  152.4,76.2 0 bottom
F8  171.45,76.2 0 bottom
F9  209.55,76.2 0 bottom
F14  190.5,76.2 0 bottom
H  145.26,19.05 0 bottom
I  185.74,38.1 0 bottom
K  183.36,19.05 0 bottom
L  207.17,19.05 0 bottom
O  204.79,38.1 0 bottom
P  221.46,57.15 0 bottom
Q  52.39,38.1 0 bottom
R  109.54,38.1 0 bottom
S  64.29,19.05 0 bottom
T  128.59,38.1 0 bottom
TAB  26.19,38.1 0 bottom
U  166.69,38.1 0 bottom
W  71.44,38.1 0 bottom
Y  147.64,38.1 0 bottom
~  21.43,57.15 0 bottom

### Tracks (layer width: path | path; a pad name or v marks a point on that pad's centre or on a via)
C1  (8 unrouted)
C2  (11 unrouted)
C3  (11 unrouted)
C4  (11 unrouted)
C5  (8 unrouted)
C6  (8 unrouted)
C7  (11 unrouted)
C8  (5 unrouted)
C9  (8 unrouted)
C10  (11 unrouted)
C11  (11 unrouted)
N$1  (3 unrouted)
N$2  (3 unrouted)
N$3  (3 unrouted)
N$4  (3 unrouted)
N$5
  Top 0.076: 9.52,85.72 238.12,85.72 238.12,9.52 9.52,9.52 9.52,85.72
N$8  (3 unrouted)
N$9  (3 unrouted)
N$10  (3 unrouted)
N$11  (3 unrouted)
N$12  (3 unrouted)
N$13  (3 unrouted)
N$14  (3 unrouted)
N$15  (3 unrouted)
N$16  (3 unrouted)
N$24  (3 unrouted)
N$25  (3 unrouted)
N$26  (3 unrouted)
N$27  (3 unrouted)
N$28  (3 unrouted)
N$29  (3 unrouted)
N$30  (3 unrouted)
N$31  (3 unrouted)
N$32  (3 unrouted)
N$38  (3 unrouted)
N$39  (3 unrouted)
N$40  (3 unrouted)
N$41  (3 unrouted)
N$42  (3 unrouted)
N$43  (3 unrouted)
N$44  (3 unrouted)
N$45  (3 unrouted)
N$54  (3 unrouted)
N$55  (3 unrouted)
N$56  (3 unrouted)
N$62  (3 unrouted)
N$63  (3 unrouted)
N$65  (3 unrouted)
N$69  (3 unrouted)
N$71  (3 unrouted)
N$72  (3 unrouted)
N$73  (3 unrouted)
R1  (9 unrouted)
R2  (9 unrouted)
R3  (9 unrouted)
R4  (6 unrouted)